# Altium schematic sheet IRSENSOR.SchDoc
size A4; SheetNumber: 5; SheetTotal: 7
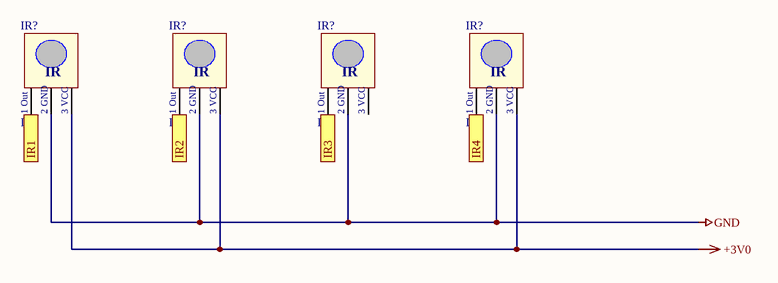
[diagram p0: IRSENSOR.SchDoc]

## Parts
(Parts that share a designator on the sheet are numbered #1, #2 ... from top to bottom, then left to right.)
IR?#1  IR  [JP3-C1T]
IR?#2  IR  [JP3-C1T]
IR?#3  IR  [JP3-C1T]
IR?#4  IR  [JP3-C1T]

## Ports
IR1, IR2, IR3, IR4

## Nets
+3V0: IR?#1.3(VCC) IR?#2.3(VCC) IR?#4.3(VCC)
GND: IR?#1.2(GND) IR?#2.2(GND) IR?#3.2(GND) IR?#4.2(GND)
IR1: IR?#1.1(Out) ; port IR1
IR2: IR?#2.1(Out) ; port IR2
IR3: IR?#3.1(Out) ; port IR3
IR4: IR?#4.1(Out) ; port IR4

Not connected (* = marked no-connect by the designer): IR?#3 3(VCC)

## Notes on the sheet
- (in symbol IR) 1 Out; 2 GND; 3 VCC

## Library data of the parts
IR?#1-IR?#4 = IR: Receiver Infraed IC